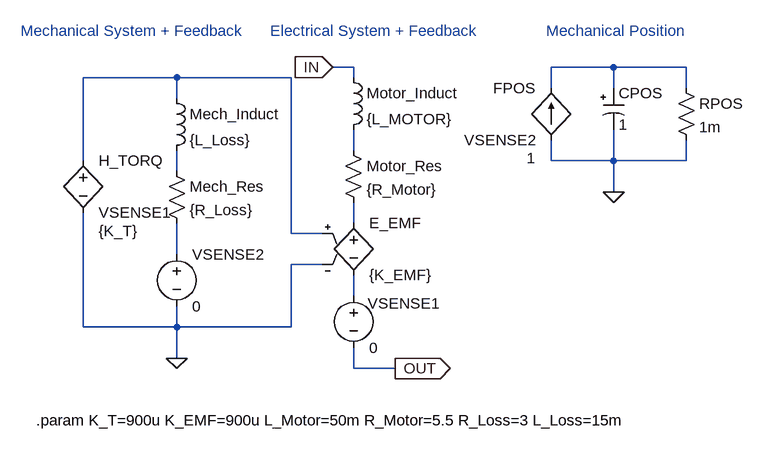
[diagram p0: schematic DCMotorCircuitModelAlternate.asc]
DCMotorCircuitModelAlternate.asc, the LTspice schematic file:
Version 4
SHEET 1 1356 808
WIRE 336 64 304 64
WIRE 736 64 640 64
WIRE 848 64 736 64
WIRE 64 80 -80 80
WIRE 240 80 64 80
WIRE 336 80 336 64
WIRE 640 96 640 64
WIRE 736 96 736 64
WIRE 848 96 848 64
WIRE 64 112 64 80
WIRE 336 192 336 160
WIRE -80 208 -80 80
WIRE 640 208 640 176
WIRE 736 208 736 160
WIRE 736 208 640 208
WIRE 848 208 848 176
WIRE 848 208 736 208
WIRE 64 224 64 192
WIRE 736 256 736 208
WIRE 336 304 336 272
WIRE 240 320 240 80
WIRE 288 320 240 320
WIRE 64 352 64 304
WIRE 288 368 240 368
WIRE 336 416 336 384
WIRE -80 464 -80 288
WIRE 64 464 64 432
WIRE 64 464 -80 464
WIRE 240 464 240 368
WIRE 240 464 64 464
WIRE 64 512 64 464
WIRE 336 528 336 496
WIRE 400 528 336 528
FLAG 304 64 IN
IOPIN 304 64 In
FLAG 400 528 OUT
IOPIN 400 528 Out
FLAG 64 512 0
FLAG 736 256 0
SYMBOL ind 320 64 R0
SYMATTR InstName Motor_Induct
SYMATTR Value {L_MOTOR}
SYMATTR SpiceLine Ipk=1.4 Rser=0.127 Rpar=16970 Cpar=1.698p
SYMBOL res 320 176 R0
SYMATTR InstName Motor_Res
SYMATTR Value {R_Motor}
SYMBOL voltage 336 400 R0
WINDOW 0 22 28 Left 2
SYMATTR InstName VSENSE1
SYMATTR Value 0
SYMBOL voltage 64 336 R0
WINDOW 123 0 0 Left 2
WINDOW 39 0 0 Left 2
SYMATTR InstName VSENSE2
SYMATTR Value 0
SYMBOL ind 48 96 R0
SYMATTR InstName Mech_Induct
SYMATTR Value {L_Loss}
SYMATTR SpiceLine Ipk=1.4 Rser=0.127 Rpar=16970 Cpar=1.698p mfg="Bourns, Inc." pn="SDE0403A-100M"
SYMBOL res 48 208 R0
SYMATTR InstName Mech_Res
SYMATTR Value {R_Loss}
SYMBOL polcap 720 96 R0
WINDOW 3 24 56 Left 2
SYMATTR Value 1
SYMATTR InstName CPOS
SYMATTR Description Capacitor
SYMATTR Type cap
SYMATTR SpiceLine V=100 Irms=15m Rser=20 Lser=0 mfg="Nichicon" pn="UPR2A010MAH" type="Al electrolytic"
SYMBOL res 832 80 R0
SYMATTR InstName RPOS
SYMATTR Value 1m
SYMBOL h -80 192 R0
WINDOW 123 24 124 Left 2
SYMATTR InstName H_TORQ
SYMATTR Value VSENSE1
SYMATTR Value2 {K_T}
SYMBOL e 336 288 R0
SYMATTR InstName E_EMF
SYMATTR Value {K_EMF}
SYMBOL f 640 176 R180
WINDOW 0 24 80 Left 2
WINDOW 3 24 0 Left 2
WINDOW 123 24 -28 Left 2
SYMATTR InstName FPOS
SYMATTR Value VSENSE2
SYMATTR Value2 1
TEXT -152 608 Left 2 !.param K_T=900u K_EMF=900u L_Motor=50m R_Motor=5.5 R_Loss=3 L_Loss=15m
TEXT -176 8 Left 2 ;Mechanical System + Feedback
TEXT 208 8 Left 2 ;Electrical System + Feedback
TEXT 632 8 Left 2 ;Mechanical Position

The netlist it stands for:
* DCMotorCircuitModelAlternate.asc
L§Motor_Induct IN N003 {L_MOTOR} Ipk=1.4 Rser=0.127 Rpar=16970 Cpar=1.698p
R§Motor_Res N003 N005 {R_Motor}
VSENSE1 N007 OUT 0
VSENSE2 N006 0 0
L§Mech_Induct N002 N004 {L_Loss} Ipk=1.4 Rser=0.127 Rpar=16970 Cpar=1.698p mfg="Bourns, Inc." pn="SDE0403A-100M"
R§Mech_Res N004 N006 {R_Loss}
CPOS N001 0 1 V=100 Irms=15m Rser=20 Lser=0 mfg="Nichicon" pn="UPR2A010MAH" type="Al electrolytic"
RPOS N001 0 1m
H_TORQ N002 0 VSENSE1 {K_T}
E_EMF N005 N007 N002 0 {K_EMF}
FPOS 0 N001 VSENSE2 1
.param K_T=900u K_EMF=900u L_Motor=50m R_Motor=5.5 R_Loss=3 L_Loss=15m
* Mechanical System + Feedback
* Electrical System + Feedback
* Mechanical Position
.backanno
.end